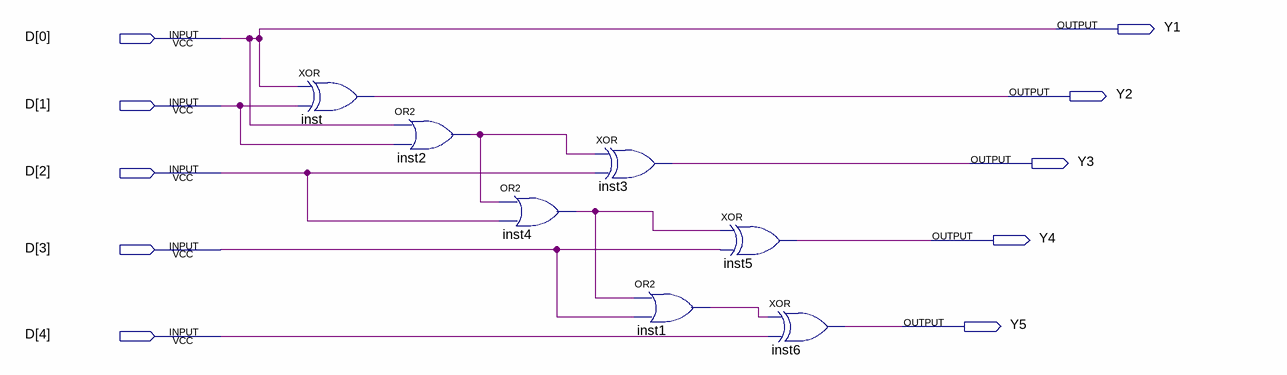
[diagram p0: schematic sheet]
// Quartus schematic complementa2.bdf as structural Verilog: 7 symbols, 10 pins
module complementa2 (
  input  [4:0] D,
  output Y1,
  output Y2,
  output Y3,
  output Y4,
  output Y5
);

  wire inst1_out, inst2_out, inst4_out;

  xor inst (Y2, D[0], D[1]);
  or inst2 (inst2_out, D[0], D[1]);
  or inst4 (inst4_out, inst2_out, D[2]);
  xor inst3 (Y3, inst2_out, D[2]);
  or inst1 (inst1_out, inst4_out, D[3]);
  xor inst5 (Y4, inst4_out, D[3]);
  xor inst6 (Y5, inst1_out, D[4]);

  assign Y1 = D[0];
endmodule
